# EAGLE design i2-mb_r1 (EAGLE 6.1)
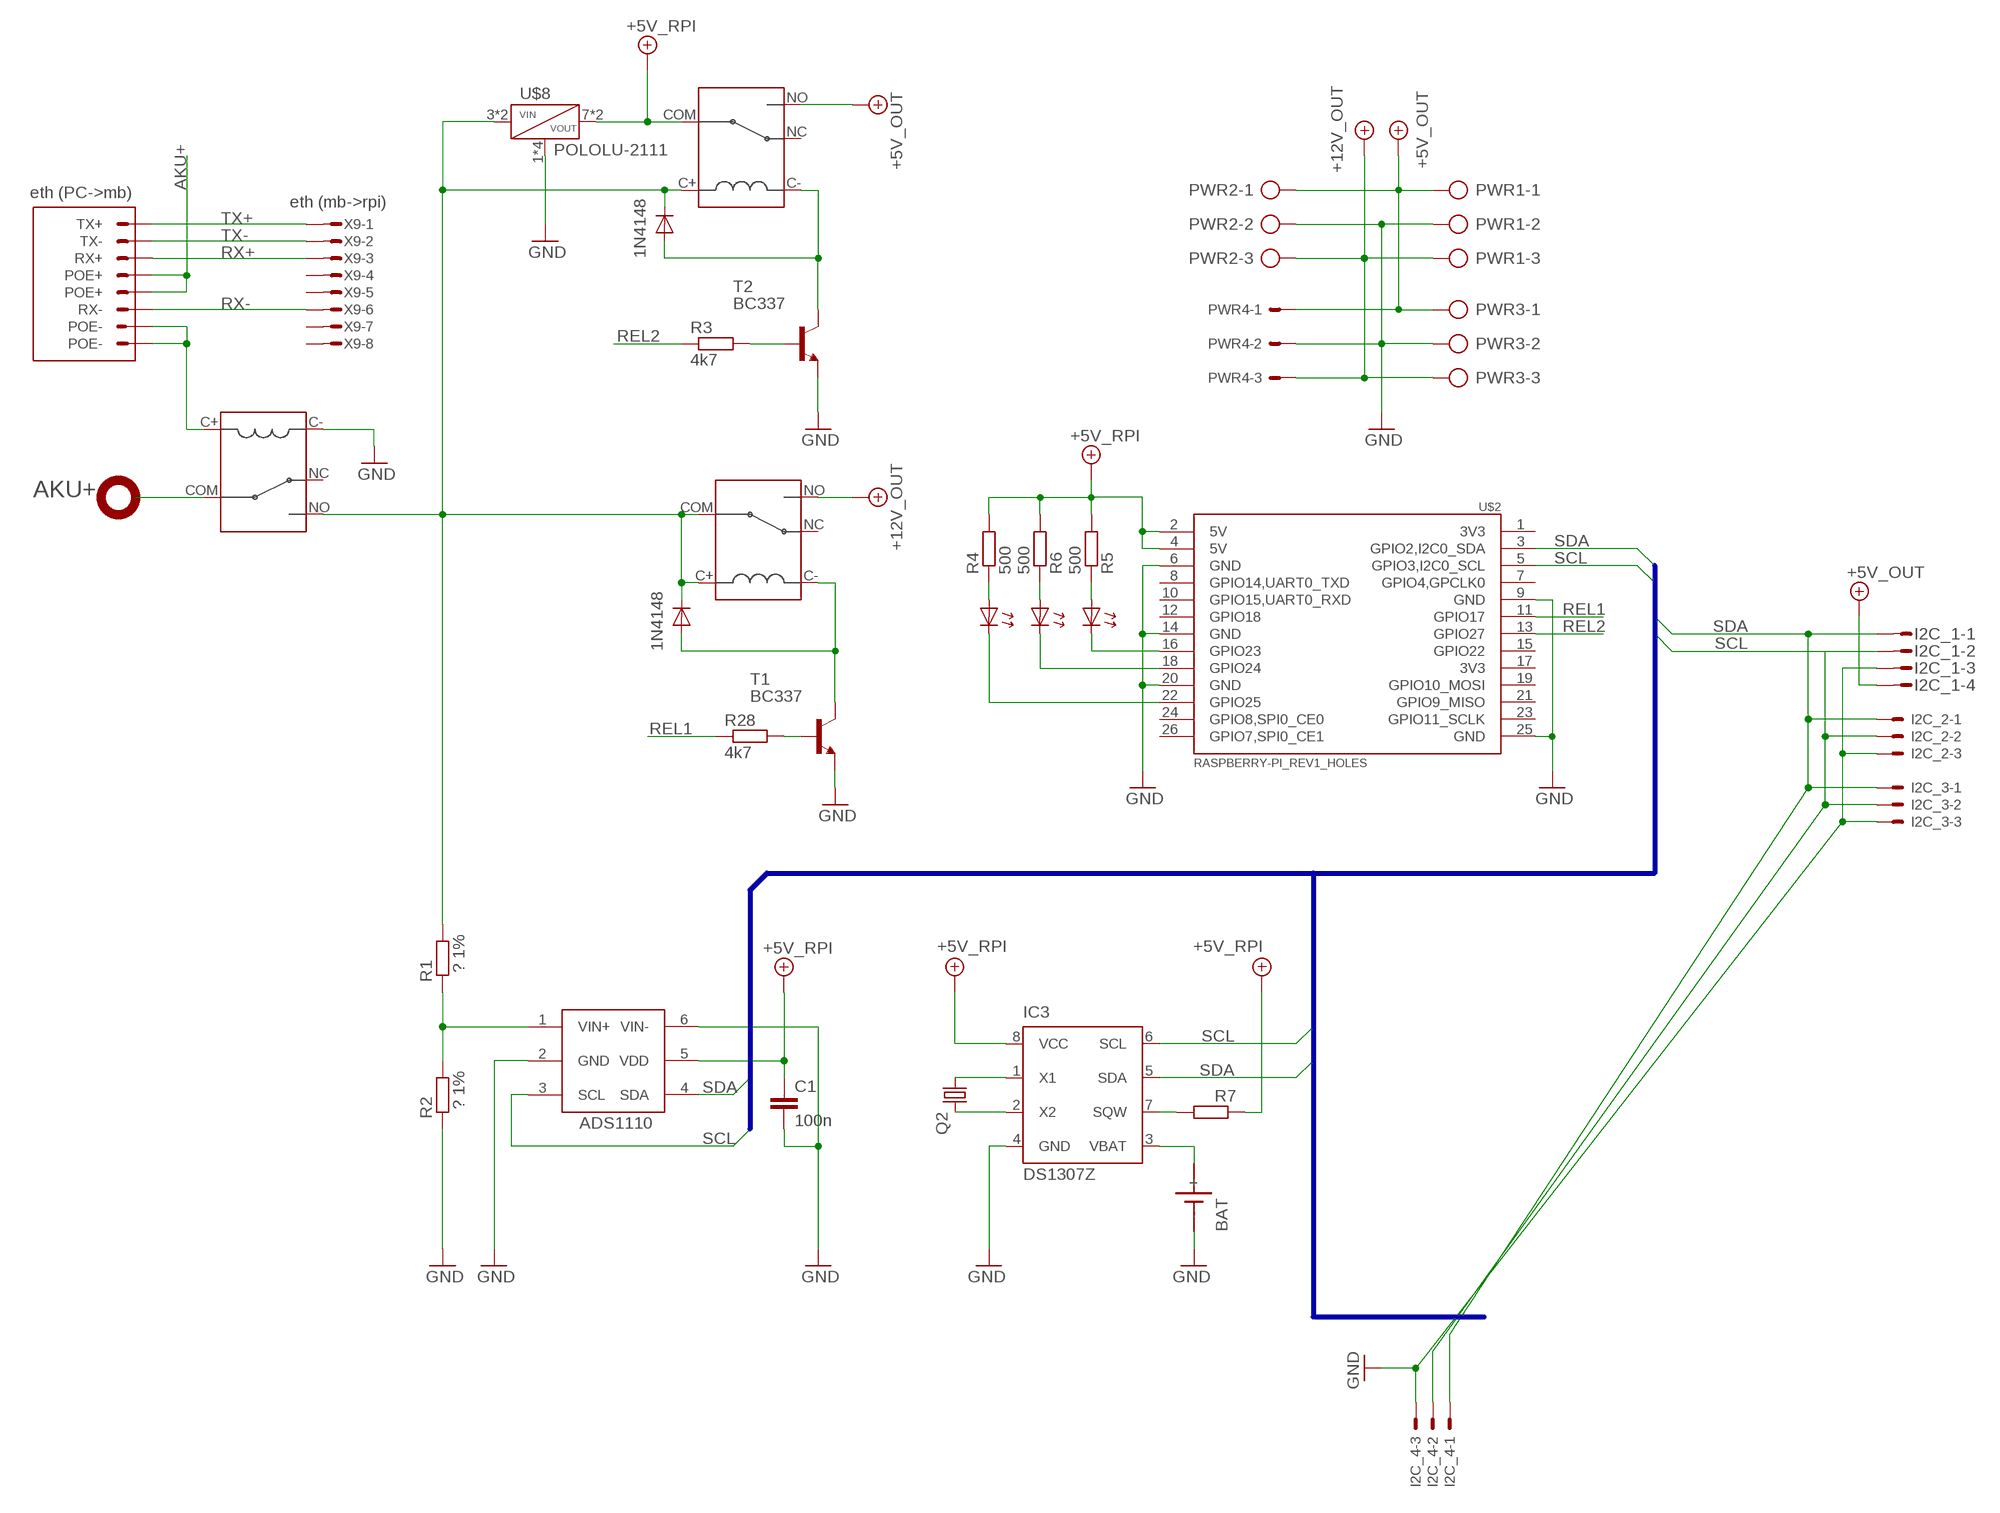
[diagram p0: schematic, sheet 1]

## Parts
BAT  SN2032  [SN2032]
C1  100n  C-EUC0603  [C0603]
I2C_1  MICROMATCH-4  [MICROMATCH-4]
I2C_2  C-GRID-03-70553  [70553-03]
I2C_3  C-GRID-03-70553  [70553-03]
I2C_4  C-GRID-03-70553  [70553-03]
IC1  ADS1110  [SOT-23-6]
IC3  DS1307Z  [SOIC8]
LED1  LED0603  [D0603]
LED2  LED0603  [D0603]
LED3  LED0603  [D0603]
PWR1  TBMP5103RC-KFV1  [TBMP5103RC-KF]
PWR2  TBMP5103RC-KFV1  [TBMP5103RC-KF]
PWR3  TBMP5103RC-KFV1  [TBMP5103RC-KF]
PWR4  C-GRID-03-70543  [70543-03]
Q2  CRYSTAL  [CFPX-217]
R1  ? 1%  R-EU_R0603  [R0603]
R2  ? 1%  R-EU_R0603  [R0603]
R3  4k7  R-EU_R0603  [R0603]
R4  500  R-EU_R0603  [R0603]
R5  500  R-EU_R0603  [R0603]
R6  500  R-EU_R0603  [R0603]
R7  R-EU_R0603  [R0603]
R28  4k7  R-EU_R0603  [R0603]
T1  BC337  [TO92]
T2  BC337  [TO92]
U$2  RASPBERRY-PI_REV1_HOLES  [RASPBERRY-PI_HOLES]
U$3  1N4148  D0603  [D0603]
U$4  1N4148  D0603  [D0603]
U$5  FBR51  [PC_RELAY]
U$6  FBR51  [PC_RELAY]
U$7  FBR51  [PC_RELAY]
U$8  POLOLU-2111  [POLOLU-2111]
X9  eth (mb->rpi)  MICROMATCH-8  [MICROMATCH-8]
X_ETH  eth (PC->mb)  RJ45  [8P8C-TOP]

## Nets
+5V: I2C_1.4 PWR1.1 PWR2.1 PWR3.1 PWR4.1 U$5.NO ; supply symbol labelled +5V_OUT
+5V_RPI: C1.1 IC1.5(VDD) IC3.8(VCC) R4.2 R5.2 R6.2 R7.1 U$2.2(5V) U$2.4(5V) U$5.COM U$8.7(VOUT) U$8.8(VOUT)
+12V_IN: R1.1 U$3.2(C) U$4.2(C) U$5.C+ U$6.NO U$7.C+ U$7.COM U$8.3(VIN) U$8.4(VIN)
+12V_OUT: PWR1.3 PWR2.3 PWR3.3 PWR4.3 U$7.NO
AKU+: U$6.COM X_ETH.4(POE+) X_ETH.5(POE+)
GND: BAT.- C1.2 I2C_1.3 I2C_2.3 I2C_3.3 I2C_4.3 IC1.2(GND) IC1.6(VIN-) IC3.4(GND) PWR1.2 PWR2.2 PWR3.2 PWR4.2 R2.2 T1.1(E) T2.1(E) U$2.6(GND) U$2.9(GND) U$2.14(GND) U$2.20(GND) U$2.25(GND) U$6.C- U$8.1(GND) U$8.2(GND) U$8.5(GND) U$8.6(GND)
LED2: LED2.2(C) U$2.16(GPIO23)
LED3: LED3.2(C) U$2.18(GPIO24)
N$1: R3.2 T2.2(B)
N$2: T2.3(C) U$3.1(A) U$5.C-
N$3: BAT.+ IC3.3(VBAT)
N$4: LED2.1(A) R5.1
N$5: LED1.1(A) R4.1
N$6: IC3.1(X1) Q2.1
N$7: LED1.2(C) U$2.22(GPIO25)
N$8: LED3.1(A) R6.1
N$9: IC3.2(X2) Q2.2
N$10: IC3.7(SQW) R7.2
N$33: T1.3(C) U$4.1(A) U$7.C-
N$41: R28.2 T1.2(B)
POE-: U$6.C+ X_ETH.7(POE-) X_ETH.8(POE-)
REL1: R28.1 U$2.11(GPIO17)
REL2: R3.1 U$2.13(GPIO27)
RX+: X9.3 X_ETH.3(RX+)
RX-: X9.6 X_ETH.6(RX-)
SCL: I2C_1.2 I2C_2.2 I2C_3.2 I2C_4.2 IC1.3(SCL) IC3.6(SCL) U$2.5(GPIO3,I2C0_SCL)
SDA: I2C_1.1 I2C_2.1 I2C_3.1 I2C_4.1 IC1.4(SDA) IC3.5(SDA) U$2.3(GPIO2,I2C0_SDA)
TX+: X9.1 X_ETH.1(TX+)
TX-: X9.2 X_ETH.2(TX-)
V_SENS: IC1.1(VIN+) R1.2 R2.1
Unconnected: U$2.1(3V3) U$2.7(GPIO4,GPCLK0) U$2.8(GPIO14,UART0_TXD) U$2.10(GPIO15,UART0_RXD) U$2.12(GPIO18) U$2.15(GPIO22) U$2.17(3V3) U$2.19(GPIO10_MOSI) U$2.21(GPIO9_MISO) U$2.23(GPIO11_SCLK) U$2.24(GPIO8,SPI0_CE0) U$2.26(GPIO7,SPI0_CE1) U$5.NC U$6.NC U$7.NC X9.4 X9.5 X9.7 X9.8

## Buses
SDA,SCL

## Notes on the sheet
- AKU+

## Library data of the parts
BAT = sn2032:SN2032: LI BATTERY
C1 = rcl:C-EU: CAPACITOR, European symbol
I2C_1 = con-amp-micromatch:MICROMATCH-4: MicroMaTch 4 7-215464-4 / 0-215464-4 Drawing Number C-215464 DDEController.pdf; MPN: 7-215464-4; OC_FARNELL: 3784629; OC_NEWARK: 19R8124
I2C_2-I2C_4 PWR4 = con-molex:C-GRID-03: CONNECTOR wire to board 2.54 mm (0.100") pitch header; OC_FARNELL: unknown; OC_NEWARK: unknown
IC1 = ads11xx:ADS1110: Analog/Digital conventer i2c Bus max: 2.048v
IC3 = ds1307_pcf8583:DS1307: I2C-Bus CLOCK/CALENDAR
LED1-LED3 = wb:LED0603
PWR1-PWR3 = con-maritex:TBMP5103RC-KF: 3pin raster 5.08 mm
Q2 = wb:CRYSTAL: CRYSTAL
R1-R7 R28 = rcl:R-EU_: RESISTOR, European symbol
T1 T2 = transistor:BC337: NPN TRANSISTOR
U$2 = RaspberryPi:RASPBERRY-PI_REV1_HOLES: Raspberry Pi Board <http://www.raspberrypi.org/> Jacques Lagnel V1.0 (beta) 2012 Mateusz Bawaj V1.1 (beta) 2012 Board dimension: Forum 3D model <http://www.raspberrypi.org/forum/general-discussion/mechanical-profile-3d-models?value=3d%20model&type=1&include=1&search=1&ret=all> The GPIO Connector (P1): http://elinux.org/RPi_Low-level_peripherals The GPIO Connector (P5): http://www.raspberrypi-spy.co.uk/2012/09/raspberry-pi-p5-header/
U$3 U$4 = wojtkowa:D0603
U$5-U$7 = wb:FBR51
U$8 = pololu:POLOLU-2111: Pololu item #: 2111
X9 = con-maritex:MICROMATCH-8: MicroMaTch 8 7-215464-8 / 0-215464-8 Drawing Number C-215464 DDEController.pdf
X_ETH = con-maritex:RJ45

## Board
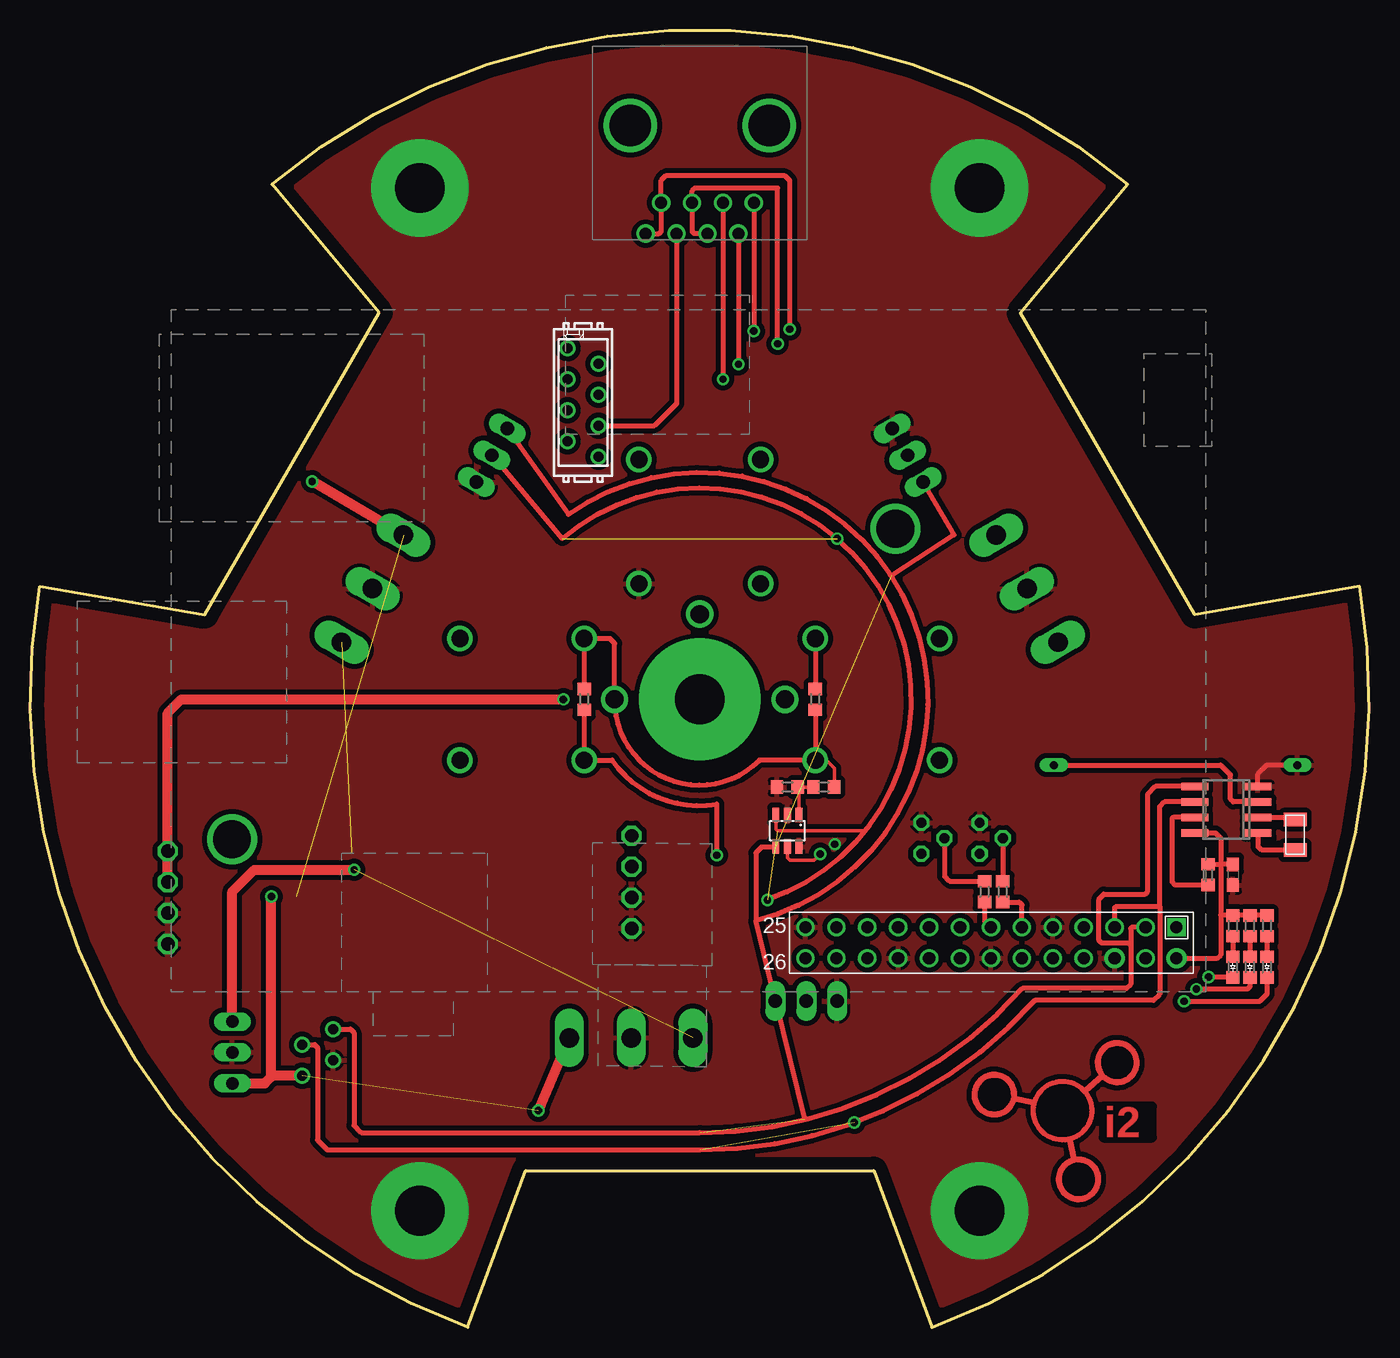
[diagram p1: board, top side]
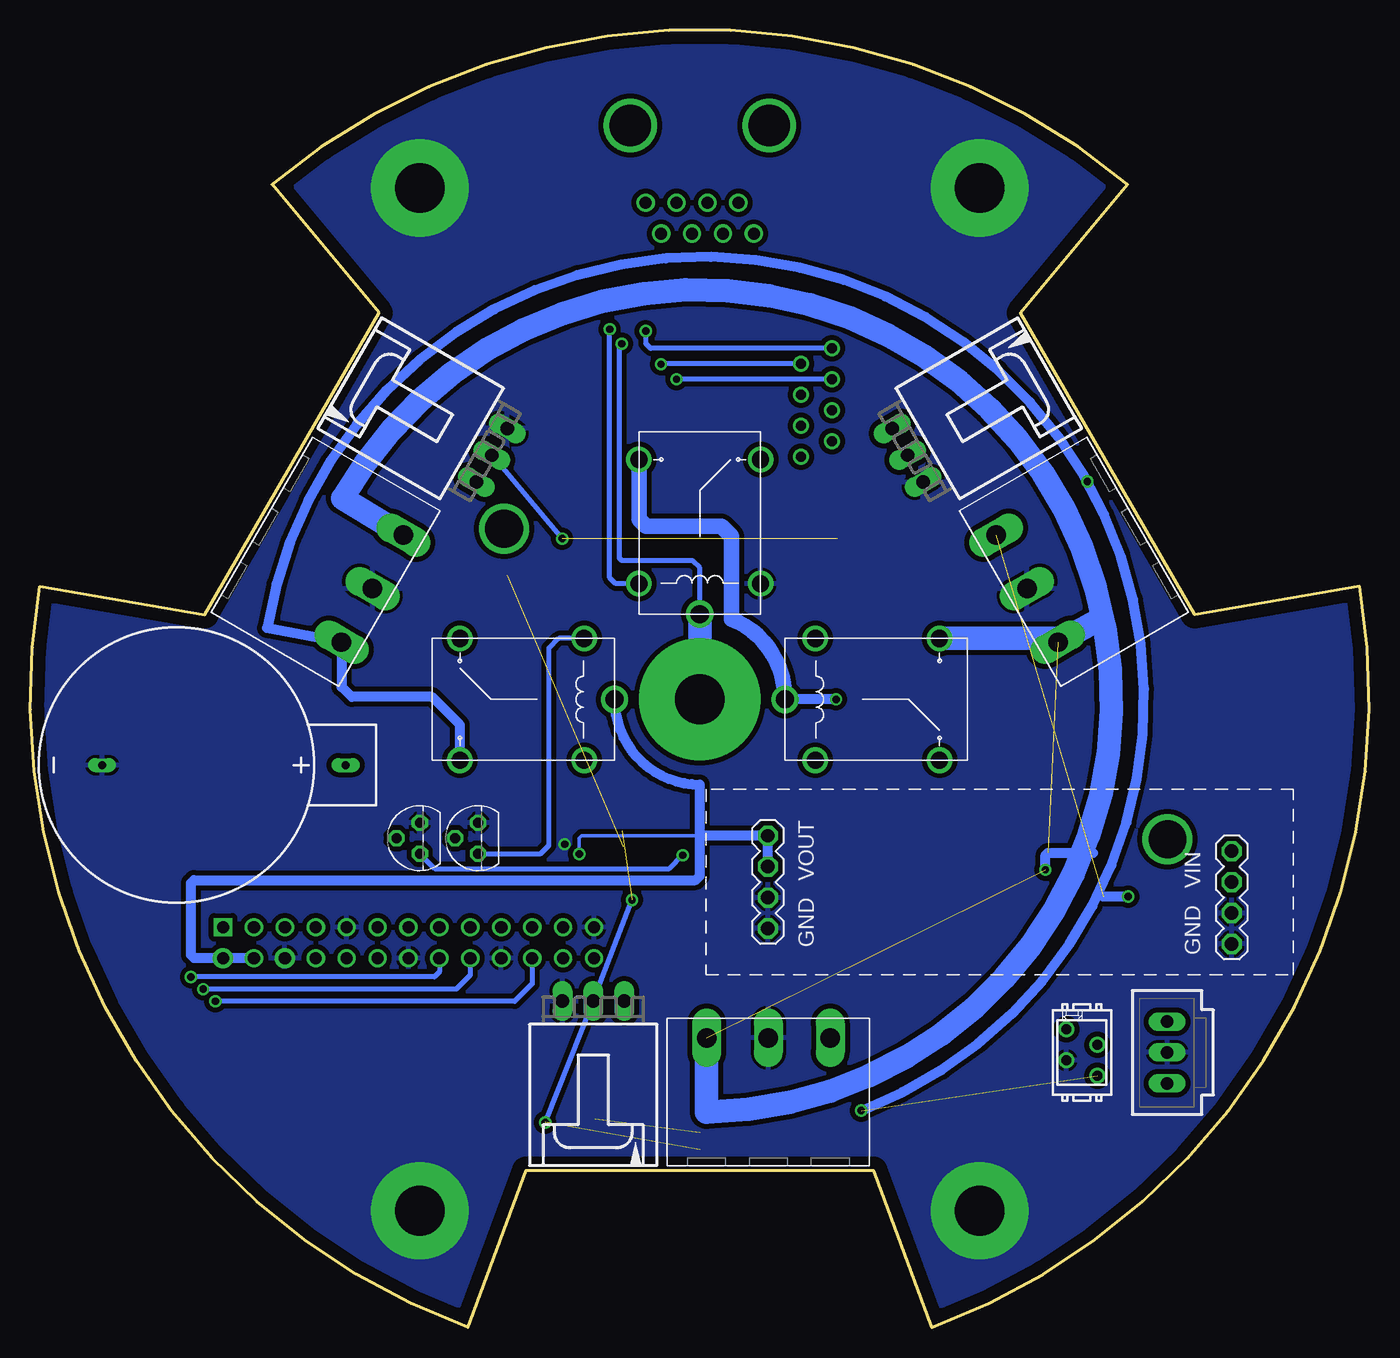
[diagram p2: board, bottom side, seen from below]

Size 109.99 x 106.53 mm. Coordinates in mm from the lower left corner, seen from the top.
Outline: 0.78,60.88 14.33,58.56 28.63,83.33 19.85,93.9 arc-79 90.14,93.9 81.36,83.33 95.66,58.56 109.2,60.88
Outline: 109.2,60.88 arc-79 74.06,0 69.29,12.89 40.69,12.89 35.93,0 arc-79 0.78,60.88
Copper layers (1*16): Top 0.035mm / dielectric 1.5mm / Bottom 0.035mm
Design rules: minimum track width 10mil, minimum drill 0.1mm, track to track 8mil, track to pad 8mil, pad to pad 8mil, via to via 8mil, smd to smd 8mil, copper to edge 40mil, drill to drill 8mil, minimum pad ring 10mil, minimum via ring 8mil, stop-mask expansion 4mil, vias tented up to drill 0mil, thermal gap 10mil

### Footprints (pad centres in the part's own frame; a part is rotated, then mirrored left to right if it is on the bottom)
SN2032 = drill 0.65 long: + 0,13.9; - 0,-6.1
C0603 = smd 1.1 x 1: 1 -0.85,0; 2 0.85,0
MICROMATCH-4 = drill 0.813: 1 1.905,1.27; 2 0.635,-1.27; 3 -0.635,1.27; 4 -1.905,-1.27
70553-03 = drill 1.092 long: 1 -2.54,-7.62; 2 0,-7.62; 3 2.54,-7.62
SOT-23-6 = smd 0.55 x 1.2: 1 -0.95,-1.3; 2 0,-1.3; 3 0.95,-1.3; 4 0.95,1.3; 5 0,1.3; 6 -0.95,1.3
SOIC8 = smd 0.6 x 2.2: 1 -1.905,-2.6; 2 -0.635,-2.6; 3 0.635,-2.6; 4 1.905,-2.6; 5 1.905,2.6; 6 0.635,2.6; 7 -0.635,2.6; 8 -1.905,2.6
D0603 = smd 1 x 1.1: 1 -0.85,0; 2 0.85,0
TBMP5103RC-KF = drill 1.6 long: 1 -5.08,0; 2 0,0; 3 5.08,0
70543-03 = drill 1.016 long: 1 -2.54,0; 2 0,0; 3 2.54,0
CFPX-217 = smd 1.1 x 1.9: 1 -1.25,0; 2 1.25,0
R0603 = smd 1 x 1.1: 1 -0.85,0; 2 0.85,0
TO92 = drill 0.813 octagon: 1 1.27,0; 2 0,1.905; 3 -1.27,0
RASPBERRY-PI_HOLES = drill 1 square: 1 -41.91,21.59 | drill 1 pad 1.676: 2 -41.91,24.13; 6 -36.83,24.13 | drill 1: 3 -39.37,21.59; 4 -39.37,24.13; 5 -36.83,21.59; 7 -34.29,21.59; 8 -34.29,24.13; 9 -31.75,21.59; 10 -31.75,24.13; 11 -29.21,21.59; 12 -29.21,24.13; 13 -26.67,21.59; 14 -26.67,24.13; 15 -24.13,21.59; 16 -24.13,24.13; 17 -21.59,21.59; 18 -21.59,24.13; 19 -19.05,21.59; 20 -19.05,24.13; 21 -16.51,21.59; 22 -16.51,24.13; 23 -13.97,21.59; 24 -13.97,24.13; 25 -11.43,21.59; 26 -11.43,24.13 | drill 3.1: P$1 -18.81,-11.135; P$2 35.69,14.365
PC_RELAY = drill 1.4: C+ 2.5,5; C- 2.5,-5; NC 12.7,-5; NO 12.7,5 | drill 1.5: COM 0,0
POLOLU-2111 = drill 1.1 octagon: 1 -17.78,5.08; 2 -17.78,2.54; 3 -17.78,0; 4 -17.78,-2.54; 5 20.32,3.81; 6 20.32,1.27; 7 20.32,-1.27; 8 20.32,-3.81
MICROMATCH-8 = drill 0.813: 1 4.445,1.27; 2 3.175,-1.27; 3 1.905,1.27; 4 0.635,-1.27; 5 -0.635,1.27; 6 -1.905,-1.27; 7 -3.175,1.27; 8 -4.445,-1.27
8P8C-TOP = drill 1: 1 -3.81,-4.445; 2 -6.35,-3.175; 3 -3.81,-1.905; 4 -6.35,-0.635; 5 -3.81,0.635; 6 -6.35,1.905; 7 -3.81,3.175; 8 -6.35,4.445 | drill 3.4: 9 2.54,5.715; 10 2.54,-5.715

### Placement (x,y rotation side)
BAT  97.99,46.19 270 bottom
C1  98.79,37.19 270 top
I2C_1  23.59,22.59 90 bottom
I2C_2  31.31,75.45 300 bottom
I2C_3  63.74,19.19 180 bottom
I2C_4  78.67,75.45 60 bottom
IC1  62.19,40.79 180 top
IC3  98.26,42.53 90 top
LED1  101.59,29.59 270 top
LED2  98.79,29.59 270 top
LED3  100.19,29.59 270 top
PWR1  49.35,23.79 180 bottom
PWR2  81.88,60.68 60 bottom
PWR3  28.1,60.68 300 bottom
PWR4  16.59,22.59 90 bottom
Q2  103.91,40.46 90 top
R1  65.19,44.39 180 top
R2  62.19,44.39 180 top
R3  78.39,35.79 90 top
R4  101.59,32.99 90 top
R5  98.79,32.99 90 top
R6  100.19,32.99 90 top
R7  96.74,37.19 270 top
R28  79.89,35.79 90 top
T1  77.99,40.19 90 bottom
T2  73.19,40.19 90 bottom
U$1  [I2-LOGO]  84.99,18.19 0 top
U$2  52.25,54.46 180 top
U$3  64.49,51.59 270 top
U$4  45.49,51.59 90 top
U$5  61.99,51.59 180 bottom
U$6  54.99,58.59 90 bottom
U$7  47.99,51.59 0 bottom
U$8  29.07,36.58 180 bottom
X9  45.4,75.97 90 top
X_ETH  54.99,96.19 90 top

### Tracks (layer width: path | path; a pad name or v marks a point on that pad's centre or on a via)
+5V  (via drill 0.6)  (2 unrouted)
  Top 0.406: 19.89,20.69 19.79,20.59
  Top 0.813: PWR1.1 v41.72,17.82 | PWR3.1 v23.14,69.49 | PWR4.1 19.25,20.05 19.79,20.59 v19.79,35.39 | I2C_1.4 19.89,20.69
  Bottom 0.813: v41.72,17.82 arc-240 90.54,57.44 PWR2.1 84.42,52.62 83.59,51.79 76.99,51.79 74.69,49.49 U$5.NO | v19.79,35.39 21.84,35.39
+5V_RPI  (via drill 0.6)
  Top 0.305: IC1.5 62.19,38.59 62.39,38.39 64.39,38.39 v64.89,38.89
  Top 0.406: IC3.8 97.36,40.63 97.79,40.19 97.79,37.99 | 97.79,37.99 97.79,33.89 | 97.79,33.89 97.79,30.59 97.53,30.33 U$2.2 94.19,30.3 | R7.1 97.74,38.04 97.79,37.99 | C1.1 97.84,38.04 97.79,37.99 | R4.2 R6.2 | R6.2 100.14,33.84 | R6.2 R5.2 97.84,33.84 97.79,33.89
  Bottom 0.305: v64.89,38.89 64.89,40.19 64.69,40.39 54.99,40.39
  Bottom 0.813: U$8.7 U$8.8 54.99,40.39 | U$5.COM arc-90 54.99,44.59 54.99,40.39 | 54.99,40.39 54.99,37.09 55.33,36.75 96.53,36.75 96.79,36.49 96.79,30.59 96.53,30.33 U$2.2 U$2.4
+12V_IN  (via drill 0.6)
  Top 0.305: R1.1 66.04,45.94 65.39,46.59 U$5.C+
  Top 0.406: U$4.2 U$7.C+ 47.59,56.59 47.99,56.19 U$7.COM arc136 59.89,46.59 U$5.C+ U$3.2
  Top 0.813: U$8.3 U$8.4 11.29,50.49 12.39,51.59 v43.79,51.59
  Bottom 0.813: v43.79,51.59 U$7.COM
  Bottom 1.27: U$6.NO 59.99,66.39 59.39,65.79 53.19,65.79 52.39,64.99 52.39,58.19 arc68 U$7.COM
+12V_OUT  (via drill 0.6)  (2 unrouted)
  Top 0.813: PWR4.3 16.59,35.79 18.39,37.59 v26.59,37.59
  Bottom 0.813: v26.59,37.59 26.59,38.79 26.39,38.99 22.69,38.99
  Bottom 1.27: 25.87,56.59 PWR3.3
  Bottom 1.93: PWR3.3 22.29,58.09 | PWR1.3 54.43,17.68 arc-240 84.34,68.09 PWR2.3 | U$7.NO 25.87,56.59
AKU+  (via drill 0.6, 4.1 pad 10)
  Top 0.406: v61.39,80.79 61.39,93.59 54.59,93.59 54.36,93.36 X_ETH.5 54.36,90.03 54.54,89.84 X_ETH.4
  Bottom 0.406: U$6.COM 54.99,62.39 55.59,62.99 61.39,62.99 61.59,63.19 61.59,80.59 v61.39,80.79
  Bottom 1.93: v54.99,51.59 U$6.COM
GND  (via drill 0.6, 4.1 pad 8)
  Top 0.406: IC3.4 100.86,45.46 101.59,46.19 BAT.-
  other vias: 31.99,93.59 77.99,93.59 77.99,9.59 31.99,9.59 66.09,39.69
  pour Bottom (isolate 0.406): 54.99,106.59 arc90 -0.01,51.59 arc90 54.99,-3.41 arc90 109.99,51.59 arc90
  pour Top (isolate 0.406): 54.99,106.59 arc90 -0.01,51.59 arc90 54.99,-3.41 arc90 109.99,51.59 arc90
LED2  (via drill 0.6)
  Top 0.406: v96.79,28.79 98.79,28.79 LED2.2
  Bottom 0.406: U$2.16 76.38,29.2 76.79,28.79 v96.79,28.79
LED3  (via drill 0.6)
  Top 0.406: LED3.2 100.19,27.99 99.99,27.79 v95.79,27.79
  Bottom 0.406: U$2.18 73.84,28.94 74.99,27.79 v95.79,27.79
N$1
  Top 0.406: T2.2 75.1,37.09 75.51,36.67 78.39,36.67 R3.2
N$2
  Top 0.406: U$5.C- U$3.1
  Bottom 0.406: T2.3 68.06,38.92 67.39,39.59 67.39,55.79 66.59,56.59 U$5.C-
N$3
  Top 0.406: IC3.3 98.82,43.17 98.59,43.39 98.59,45.39 97.79,46.19 BAT.+
N$4
  Top 0.406: R5.1 LED2.1
N$5
  Top 0.406: R4.1 LED1.1
N$6
  Top 0.406: Q2.1 101.17,39.21 100.86,39.52 IC3.1
N$7  (via drill 0.6)
  Top 0.406: v94.79,26.79 100.99,26.79 101.59,27.39 LED1.2
  Bottom 0.406: U$2.22 68.76,28.22 70.19,26.79 v94.79,26.79
N$8
  Top 0.406: R6.1 LED3.1
N$9
  Top 0.305: 103.73,41.9 Q2.2
  Top 0.406: IC3.2 103.73,41.9
N$10
  Top 0.406: IC3.7 93.9,41.9 93.79,41.79 93.79,36.59 94.04,36.34 R7.2
N$33  (via drill 0.6)
  Top 0.406: U$4.1 U$7.C- 47.79,46.59 arc64 56.39,42.99 v56.39,38.79
  Bottom 0.406: v56.39,38.79 57.49,37.69 76.76,37.69 T1.3
N$41
  Top 0.406: T1.2 R28.2
POE-  (via drill 0.6)
  Top 0.406: v62.39,81.99 62.39,94.19 61.99,94.59 52.19,94.59 51.82,94.22 X_ETH.7 51.82,90.02 51.64,89.84 X_ETH.8
  Bottom 0.406: U$6.C+ 61.89,61.09 62.39,61.59 v62.39,81.99
REL1
  Top 0.406: U$2.11 81.46,34.72 81.24,34.94 R28.1
REL2
  Top 0.406: R3.1 78.39,33.39 U$2.13
RX+  (via drill 0.6)
  Top 0.406: X_ETH.3 v56.9,77.89
  Bottom 0.406: X9.3 56.9,77.88 v56.9,77.89
RX-
  Top 0.406: X_ETH.6 53.09,75.89 51.27,74.07 X9.6
SCL  (via drill 0.6)  (4 unrouted)
  Top 0.305: IC1.3 61.24,40.94 61.39,40.79 68.59,40.79
  Top 0.406: U$2.5 89.08,34.48 89.19,34.59 92.79,34.59 | 92.79,34.59 92.79,27.39 92.26,26.86 82.51,26.86 arc-48 54.99,14.59 24.39,14.59 23.59,15.39 23.59,22.99 23.36,23.23 I2C_1.2 | 92.79,34.59 92.79,42.79 93.17,43.17 IC3.6 | I2C_2.2 43.69,64.79 arc-202 60.54,35.14
  Bottom 0.406: v67.69,16.84 I2C_3.2 v60.56,35.12 | I2C_4.2 v66.29,64.79
SDA  (2 unrouted)
  Top 0.305: 81.52,27.86
  Top 0.406: IC1.4 61.2,39.45 60.05,39.45 59.59,38.99 59.59,33.39 | U$2.3 90.47,32.87 90.39,32.79 90.39,31.39 | 90.39,31.39 90.39,28.19 90.06,27.86 81.52,27.86 | 81.52,27.86 arc-48 54.99,16 27.18,16 26.59,16.59 26.59,24.19 26.29,24.5 I2C_1.1 | 63.6,17.1 I2C_3.1 59.59,33.39 | 90.39,31.39 90.19,31.59 87.99,31.59 87.79,31.79 87.79,35.19 88.19,35.59 91.59,35.59 91.79,35.79 91.79,43.79 92.44,44.44 IC3.5 | I2C_2.1 44.19,66.79 arc-201 59.59,33.39 | I2C_4.1 75.89,65.09 70.79,61.79
TX+  (via drill 0.6)
  Top 0.406: X_ETH.1 v59.44,81.84
  Bottom 0.406: X9.1 59.02,80.42 59.44,80.84 v59.44,81.84
TX-  (via drill 0.6)
  Top 0.406: X_ETH.2 v58.17,79.12
  Bottom 0.406: X9.2 58.14,79.15 v58.17,79.12
V_SENS
  Top 0.305: R1.2 R2.1 63.14,44.29 IC1.1